# EAGLE design Grove - 3-Axis Digital Accelerometer(±16g) v1.1 (EAGLE 6.3)
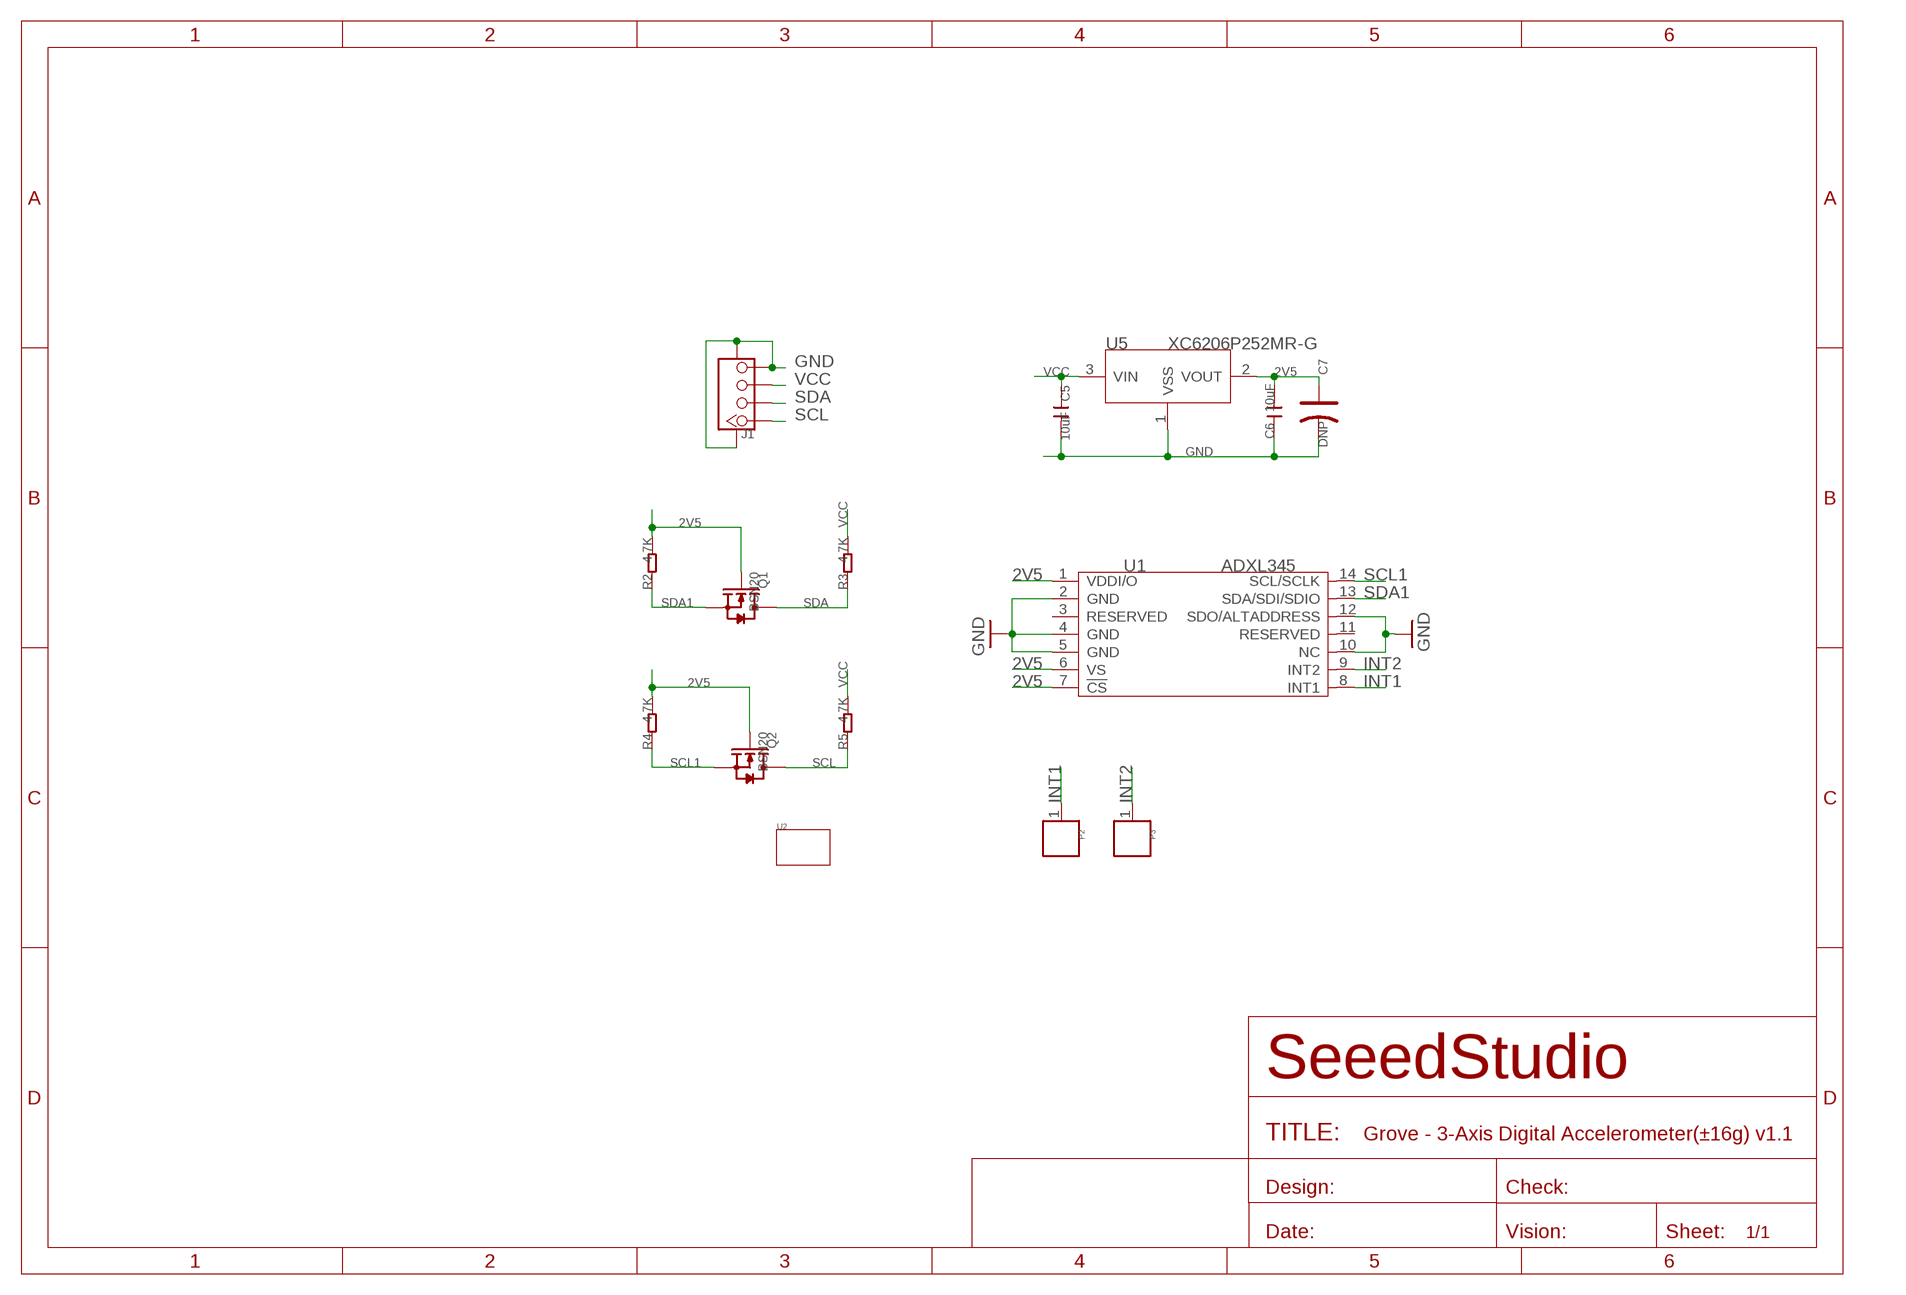
[diagram p0: schematic, sheet 1]

## Parts
C5  10uF  C-0805  [C0805]
C6  10uF  C-0805  [C0805]
C7  DNP  CAP-AVX-A  [AVX-A]
J1  TWIG-4P-2.0-SMD-FEMALE-REINFORCE'DD'  [4P-SMD-2.0]
P2  PAD'60/30'  [1P-65/35MIL]
P3  PAD'60/30'  [1P-65/35MIL]
Q1  BSN20  MOSFET-N'SOT23'  [SOT23]
Q2  BSN20  MOSFET-N'SOT23'  [SOT23]
R2  4.7K  R-0603  [R0603]
R3  4.7K  R-0603  [R0603]
R4  4.7K  R-0603  [R0603]
R5  4.7K  R-0603  [R0603]
U1  ADXL345  [LGA14]
U2  TWIG-1U  [1U-DIM-W/-DRILL]
U5  XC6206P252MR-G  XC6206MR  [SOT23]

## Nets
2V5: C6.2 C7.+ Q1.1(G) Q2.1(G) R2.2 R4.2 U1.1(VDDI/O) U1.6(VS) U1.7(!CS) U5.2(VOUT)
GND: C5.2 C6.1 C7.- J1.4 J1.SS1 J1.SS2 U1.2(GND) U1.4(GND) U1.5(GND) U1.10(NC) U1.12(SDO/ALTADDRESS) U5.1(VSS)
INT1: P2.1 U1.8(INT1)
INT2: P3.1 U1.9(INT2)
SCL: J1.1 Q2.3(D) R5.1
SCL1: Q2.2(S) R4.1 U1.14(SCL/SCLK)
SDA: J1.2 Q1.3(D) R3.1
SDA1: Q1.2(S) R2.1 U1.13(SDA/SDI/SDIO)
VCC: C5.1 J1.3 R3.2 R5.2 U5.3(VIN)
Unconnected: U1.3(RESERVED) U1.11(RESERVED)

## Library data of the parts
C5 C6 = Discrete:C*: Ceramic Capacitors
C7 = Discrete:CAP*: Electrolytic Capacitors,Tantalum Capacitors and Super Capacitors
J1 = Connector:TWIG-4P-2.0-SMD-FEMALE-REINFORCE
P2 P3 = Discrete:PAD
Q1 Q2 = Discrete:MOSFET-N: IRLL014: http://www.vishay.com/docs/91319/sihll014.pdf
R2-R5 = Discrete:R*
U1 = IC:ADXL345: 3-Axis,+/-2g / +/-4g / +/-8g / +/-16g Digital Accelerometer
U2 = Module:TWIG
U5 = IC:XC6206: LOW ESR Cap.Compatible Positive Voltage Regulators

## Board
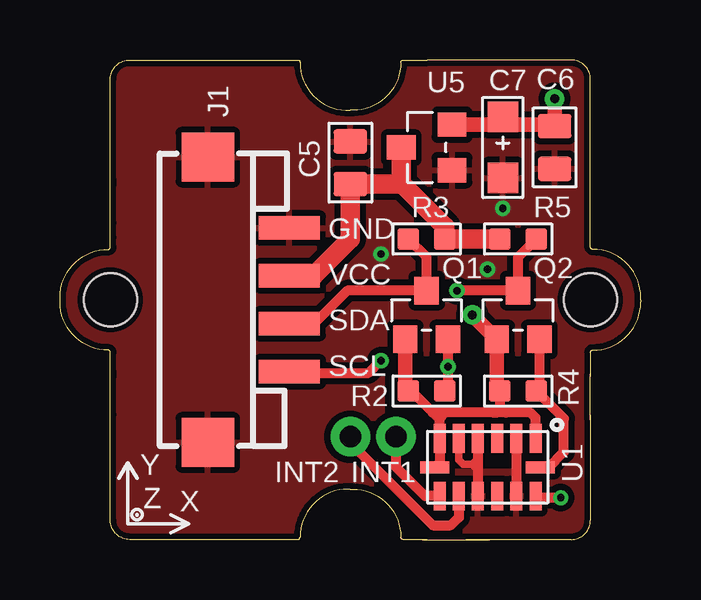
[diagram p1: board, top side]
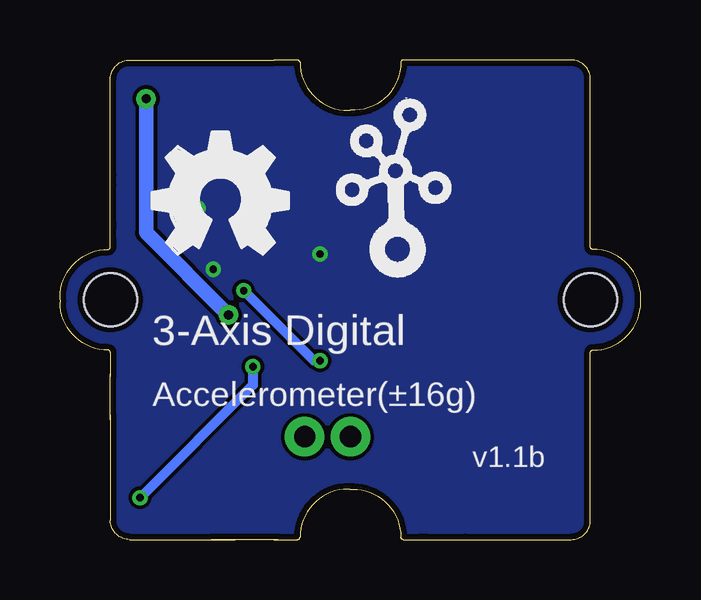
[diagram p2: board, bottom side, seen from below]

Size 24.2 x 20 mm. Coordinates in mm from the lower left corner, seen from the top.
Copper layers (1*16): Top 0.035mm / dielectric 1.5mm / Bottom 0.035mm
Design rules "SeeedStudio_rule_no_angle_090911 *": minimum track width 6mil, minimum drill 12mil, track to track 6mil, track to pad 6mil, pad to pad 6mil, via to via 6mil, smd to smd 0mil, copper to edge 10mil, drill to drill 10mil, minimum pad ring 10mil, minimum via ring 6mil, stop-mask expansion 2mil, vias tented up to drill 100mil, thermal gap 10mil
tRestrict: area 14,3.4 to 19.3,7.2

### Footprints (pad centres in the part's own frame; a part is rotated, then mirrored left to right if it is on the bottom)
C0805 = smd 1.016 x 1.397: 1 -0.889,0; 2 0.889,0
AVX-A = smd 1.27 x 1.27: + -1.27,0; - 1.27,0
4P-SMD-2.0 = smd 0.965 x 2.54: 1 -3,0; 2 -1,0; 3 1,0; 4 3,0 | smd 2.032 x 2.184: SS1 -5.946,3.4; SS2 5.946,3.4
1P-65/35MIL = drill 0.889 pad 1.651: 1 0,0
SOT23 = smd 1.016 x 1.143: 1 -0.889,-1.016; 2 0.889,-1.016; 3 0,1.016
R0603 = smd 0.889 x 0.889: 1 -0.762,0; 2 0.762,0
LGA14 = smd 1.2 x 0.5: 1 -1.2,2; 2 -1.2,1.2; 3 -1.2,0.4; 4 -1.2,-0.4; 5 -1.2,-1.2; 6 -1.2,-2; 8 1.2,-2; 9 1.2,-1.2; 10 1.2,-0.4; 11 1.2,0.4; 12 1.2,1.2; 13 1.2,2 | smd 0.5 x 1.2: 7 0,-2.2; 14 0,2.2
1U-DIM-W/-DRILL = hole 2.2: 0,-10; 0,10
SOT23' = smd 1.016 x 1.2: 1 -0.95,-1.06; 2 0.95,-1.06; 3 0,1.06

### Placement (x,y rotation side)
C5  12.1,15.71 90 top
C6  20.61,16.35 90 top
C7  18.45,16.35 270 top
J1  9.56,10 90 top
P2  14,4.29 270 top
P3  12.1,4.29 270 top
Q1  15.27,9.37 0 top
Q2  19.09,9.37 0 top
R2  15.27,6.19 180 top
R3  15.27,12.54 0 top
R4  19.09,6.19 180 top
R5  19.09,12.54 180 top
U1  17.81,3.01 270 top
U2  12.1,10 90 top
U5  XC6206P252MR-G  [SOT23']  15.27,16.35 90 top
U$1  [OSHW_FILLX200_NOTEXT]  20.36,11.9 0 bottom
U$3  [TWIGLOGO]  10.2,11.9 0 bottom

### Tracks (layer width: path | path; a pad name or v marks a point on that pad's centre or on a via)
2V5  (via drill 0.38 pad 0.81)
  Top 0.406: U1.7 15.81,3.21 U1.6 15.81,5.01 | 15.81,5.01 15.53,5.3 | 15.53,5.3 14.64,6.19 R2.2 | U1.1 19.81,5.08 19.59,5.3 18.58,5.3 | 18.58,5.3 18.2,5.3 | 18.2,5.3 18.07,5.3 | 18.07,5.3 16.04,5.3 | 16.04,5.3 15.53,5.3 | R4.2 18.32,5.55 | 18.32,5.55 18.32,5.43 18.2,5.3 | 15.81,5.01 15.81,5.08 16.04,5.3 | 18.07,5.3 18.32,5.55 | 18.32,5.55 18.58,5.3
  Top 0.61: 18.13,17.3 C7.+ | 18.13,17.3 20.55,17.3 C6.2 v20.61,18.38 | Q1.1 14.39,6.32 R2.2 | R4.2 18.2,6.32 Q2.1 v17.18,9.37 | 18.13,17.3 U5.2
  Bottom 0.61: v20.61,18.38 20.61,12.79 v17.18,9.37
GND  (via drill 0.3 pad 0.64)
  Top 0.305: U1.5 16.61,3.33 16.8,3.14 17.18,3.14 | 17.18,3.14 17.29,3.14 17.41,3.27 | 17.18,3.14 17.31,3.27 | 17.18,3.14 17.31,3.01
  Top 0.406: U1.2 U1.12 | U1.4 17.41,3.27 U1.10
  other vias: 13.37,11.9 17.81,11.27 18.45,13.81
  pour Bottom: -0.98,23.34 25.18,23.34 25.18,-3.34 -0.98,-3.34
  pour Top (isolate 0.254): -0.98,23.34 25.18,23.34 25.18,-3.34 -0.98,-3.34
INT1
  Top 0.406: U1.8 15.21,1.81 14,3.01 P2.1
INT2
  Top 0.406: U1.9 16.61,0.93 16.29,0.6 15.53,0.6 12.1,4.03 P3.1
SCL  (via drill 0.3 pad 0.64)
  Top 0.406: R5.1 19.09,11.78 Q2.3 v16.55,10.38 | J1.1 9.61,6.95 12.86,6.95 v13.37,7.46
  Bottom 0.406: v13.37,7.46 13.62,7.46 v16.55,10.38
SCL1
  Top 0.406: Q2.2 19.97,6.32 R4.1 20.99,5.05 20.99,3.65 20.36,3.01 U1.14
SDA
  Top 0.406: R3.1 15.27,11.78 Q1.3 11.97,10.38 10.58,8.98 9.58,8.98 J1.2
SDA1  (via drill 0.3 pad 0.64)
  Top 0.406: Q1.2 v16.16,7.21 16.16,6.32 R2.1 | v20.86,1.74 19.88,1.74 U1.13
  Bottom 0.406: v16.16,7.21 16.16,6.44 v20.86,1.74
VCC
  Top 0.813: J1.3 9.58,11.02 10.58,11.02 12.1,12.54 C5.1 14.13,14.83 | R5.2 R3.2 16.04,13.05 14.26,14.83 14.13,14.83 | U5.3 14.21,14.91 14.13,14.83

### Text on the board
tPlace: GND | VCC | SDA | SCL
bPlace: 3-Axis Digital | Accelerometer(±16g) | v1.1b
tNames: Y | INT2 | INT1 | Z | X